# EAGLE design odrive-hat (EAGLE 9.6.2)
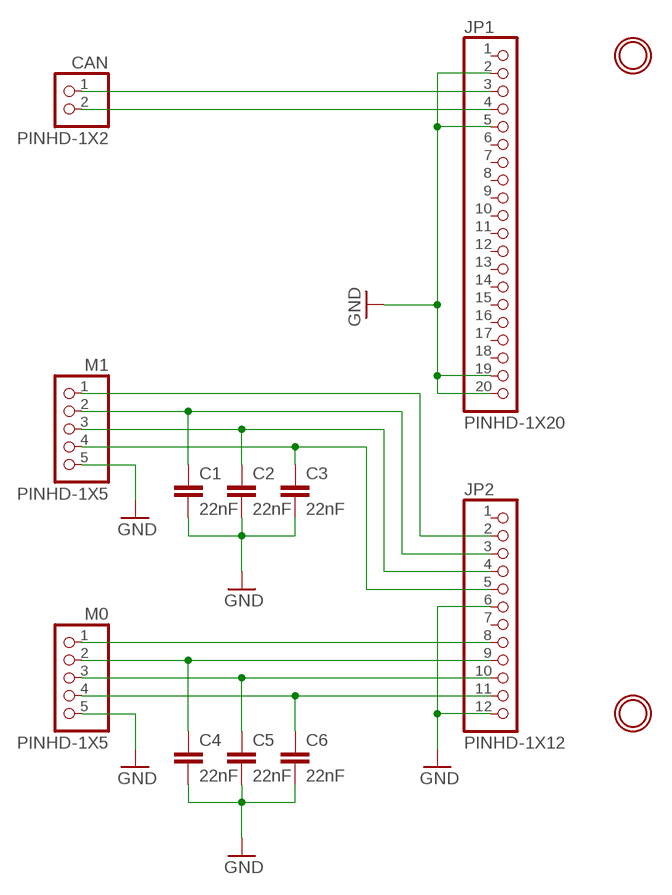
[diagram p0: schematic, sheet 1]

## Parts
C1  22nF  C-EUC0603  [C0603]
C2  22nF  C-EUC0603  [C0603]
C3  22nF  C-EUC0603  [C0603]
C4  22nF  C-EUC0603  [C0603]
C5  22nF  C-EUC0603  [C0603]
C6  22nF  C-EUC0603  [C0603]
CAN  PINHD-1X2  [1X02]
JP1  PINHD-1X20  [1X20]
JP2  PINHD-1X12  [1X12]
M0  PINHD-1X5  [1X05]
M1  PINHD-1X5  [1X05]
U$1  MICROBUILDER_MOUNTINGHOLE3.0THIN  [MICROBUILDER_MOUNTINGHOLE_3.0_PLATEDTHIN]
U$2  MICROBUILDER_MOUNTINGHOLE3.0THIN  [MICROBUILDER_MOUNTINGHOLE_3.0_PLATEDTHIN]

## Nets
GND: C1.2 C2.2 C3.2 C4.2 C5.2 C6.2 JP1.2 JP1.5 JP1.19 JP1.20 JP2.6 JP2.12 M0.5 M1.5
N$1: CAN.1 JP1.3
N$2: CAN.2 JP1.4
N$4: C3.1 JP2.5 M1.4
N$5: C2.1 JP2.4 M1.3
N$6: C6.1 JP2.11 M0.4
N$7: C5.1 JP2.10 M0.3
N$8: C4.1 JP2.9 M0.2
N$9: JP2.8 M0.1
N$10: C1.1 JP2.3 M1.2
N$11: JP2.2 M1.1
Unconnected: JP1.1 JP1.6 JP1.7 JP1.8 JP1.9 JP1.10 JP1.11 JP1.12 JP1.13 JP1.14 JP1.15 JP1.16 JP1.17 JP1.18 JP2.1 JP2.7

## Library data of the parts
C1-C6 = rcl:C-EU: CAPACITOR, European symbol; SPICEPREFIX: C
CAN = Connector:PINHD-1X2: PIN HEADER; CATEGORY: CONNECTOR; SUB-CATEGORY: PIN-HEADER
JP1 = Connector:PINHD-1X20: PIN HEADER; CATEGORY: CONNECTOR; SUB-CATEGORY: PIN-HEADER
JP2 = Connector:PINHD-1X12: PIN HEADER; CATEGORY: CONNECTOR; SUB-CATEGORY: PIN-HEADER
M0 M1 = Connector:PINHD-1X5: PIN HEADER; CATEGORY: CONNECTOR; SUB-CATEGORY: PIN-HEADER
U$1 U$2 = Adafruit_INA219_CurPowerMonitor:MICROBUILDER_MOUNTINGHOLE: Mounting Hole For #2 screws (0.086"/2.18mm width, 0.094"/2.4mm hole) use 2.5mm

## Board
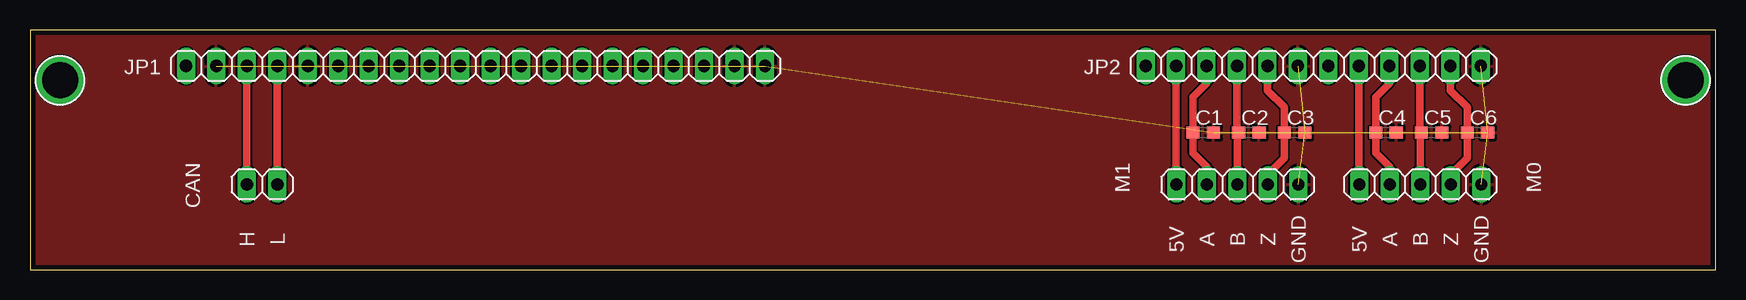
[diagram p1: board, top side]

Size 140.5 x 20 mm. Coordinates in mm from the lower left corner, seen from the top.
Outline: 0,0 140.5,0 140.5,20 0,20 0,0
Copper layers (1*16): Top 0.035mm / dielectric 1.5mm / Bottom 0.035mm
Design rules "default *": minimum track width 6mil, minimum drill 0.35mm, track to track 6mil, track to pad 6mil, pad to pad 6mil, via to via 6mil, smd to smd 6mil, copper to edge 16mil, drill to drill 6mil, minimum pad ring 10mil, minimum via ring 8mil, stop-mask expansion 4mil, vias tented up to drill 0mil, thermal gap 10mil

### Footprints (pad centres in the part's own frame; a part is rotated, then mirrored left to right if it is on the bottom)
C0603 = smd 1.1 x 1: 1 -0.85,0; 2 0.85,0
1X02 = drill 1.016 long: 1 -1.27,0; 2 1.27,0
1X20 = drill 1.016 long: 1 -24.13,0; 2 -21.59,0; 3 -19.05,0; 4 -16.51,0; 5 -13.97,0; 6 -11.43,0; 7 -8.89,0; 8 -6.35,0; 9 -3.81,0; 10 -1.27,0; 11 1.27,0; 12 3.81,0; 13 6.35,0; 14 8.89,0; 15 11.43,0; 16 13.97,0; 17 16.51,0; 18 19.05,0; 19 21.59,0; 20 24.13,0
1X12 = drill 1.016 long: 1 -13.97,0; 2 -11.43,0; 3 -8.89,0; 4 -6.35,0; 5 -3.81,0; 6 -1.27,0; 7 1.27,0; 8 3.81,0; 9 6.35,0; 10 8.89,0; 11 11.43,0; 12 13.97,0
1X05 = drill 1.016 long: 1 -5.08,0; 2 -2.54,0; 3 0,0; 4 2.54,0; 5 5.08,0
MICROBUILDER_MOUNTINGHOLE_3.0_PLATEDTHIN = drill 3 pad 3.6: P$1 0,0

### Placement (x,y rotation side)
C1  97.79,11.43 0 top
C2  101.6,11.43 0 top
C3  105.41,11.43 0 top
C4  113.03,11.43 0 top
C5  116.84,11.43 0 top
C6  120.65,11.43 0 top
CAN  19.35,7.11 0 top
JP1  37.13,17 0 top
JP2  106.97,17 0 top
M0  115.89,7.11 0 top
M1  100.65,7.11 0 top
U$1  138,15.8 0 top
U$2  2.5,15.8 0 top

### Tracks (layer width: path | path; a pad name or v marks a point on that pad's centre or on a via)
GND  (13 unrouted)
  pour Top: -2.5,23 143,23 143,-3 -2.5,-3
N$1
  Top 0.61: JP1.3 CAN.1
N$2
  Top 0.61: JP1.4 CAN.2
N$4
  Top 0.61: JP2.5 103.16,14.95 104.56,13.55 C3.1 104.56,9.31 103.19,7.94 M1.4
N$5
  Top 0.61: JP2.4 100.62,11.56 100.65,11.53 | 100.65,11.53 C2.1 | M1.3 100.65,11.53
N$6
  Top 0.61: JP2.11 118.4,14.95 119.8,13.55 C6.1 119.8,9.31 118.43,7.94 M0.4
N$7
  Top 0.61: JP2.10 115.86,11.56 C5.1 115.89,11.33 M0.3
N$8
  Top 0.61: JP2.9 113.32,15.53 112.18,14.39 C4.1 112.18,9.74 113.35,8.57 M0.2
N$9
  Top 0.61: JP2.8 110.78,7.14 M0.1
N$10
  Top 0.61: JP2.3 98.08,15.53 96.94,14.39 C1.1 96.94,9.74 98.11,8.57 M1.2
N$11
  Top 0.61: JP2.2 95.54,7.14 M1.1

### Text on the board
tNames: H | L | 5V | A | B | Z | GND | 5V | A | B | Z | GND